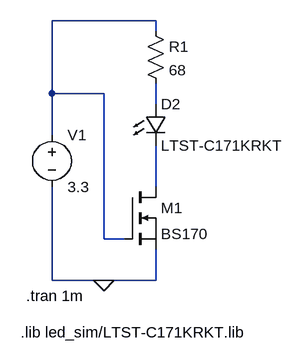
[diagram p0: schematic led-drive-fet.asc]
led-drive-fet.asc, the LTspice schematic file:
Version 4.1
SHEET 1 880 680
WIRE 288 -32 128 -32
WIRE 288 -16 288 -32
WIRE 128 80 128 -32
WIRE 208 80 128 80
WIRE 288 96 288 64
WIRE 128 144 128 80
WIRE 288 224 288 160
WIRE 208 304 208 80
WIRE 240 304 208 304
WIRE 128 368 128 224
WIRE 208 368 128 368
WIRE 288 368 288 320
WIRE 288 368 208 368
FLAG 208 368 0
SYMBOL voltage 128 128 R0
WINDOW 123 0 0 Left 0
WINDOW 39 0 0 Left 0
SYMATTR InstName V1
SYMATTR Value 3.3
SYMBOL nmos 240 224 R0
SYMATTR InstName M1
SYMATTR Value BS170
SYMBOL LED 272 96 R0
SYMATTR InstName D2
SYMATTR Value LTST-C171KRKT
SYMBOL res 272 -32 R0
SYMATTR InstName R1
SYMATTR Value 68
TEXT 88 392 Left 2 !.tran 1m
TEXT 80 448 Left 2 !.lib led_sim/LTST-C171KRKT.lib

The netlist it stands for:
* led-drive-fet.asc
V1 N001 0 3.3
M1 N003 N001 0 0 BS170
D2 N002 N003 LTST-C171KRKT
R1 N001 N002 68
.model D D
.lib standard.dio
.model NMOS NMOS
.model PMOS PMOS
.lib standard.mos
.tran 1m
.lib led_sim/LTST-C171KRKT.lib
.backanno
.end